# EAGLE design Grove-Encoder v0.9b (EAGLE 6.1)
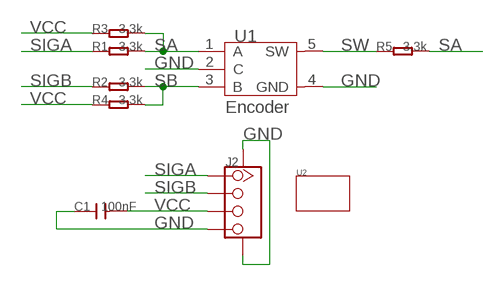
[diagram p0: schematic, sheet 1]

## Parts
C1  100nF  C-0603  [C0603]
J2  TWIG-4P-2.0-SMD-FEMALE-REINFORCE'DD'  [4P-SMD-2.0]
R1  3.3k  R-0603  [R0603]
R2  3.3k  R-0603  [R0603]
R3  3.3k  R-0603  [R0603]
R4  3.3k  R-0603  [R0603]
R5  3.3k  R-0603  [R0603]
U1  Encoder  ROTARY-ENCODE-5P  [5P-13.75X11.7X6.5H]
U2  TWIG'1U'  [1U-DIM-W/-DRILL]

## Nets
GND: C1.1 J2.4 J2.SS1 J2.SS2 U1.2(C) U1.4(GND)
SA: R1.2 R3.2 R5.2 U1.1(A)
SB: R2.2 R4.2 U1.3(B)
SIGA: J2.1 R1.1
SIGB: J2.2 R2.1
SW: R5.1 U1.5(SW)
VCC: C1.2 J2.3 R3.1 R4.1

## Library data of the parts
C1 = Discrete:C*: Ceramic Capacitors
J2 = Connector:TWIG-4P-2.0-SMD-FEMALE-REINFORCE
R1-R5 = Discrete:R*
U1 = template:ROTARY-ENCODE-5P: Rotary Encode With Switch http://www.seeedstudio.com/depot/rotary-encoder-with-switch-p-667.html?cPath=156_160
U2 = moudle:TWIG

## Board
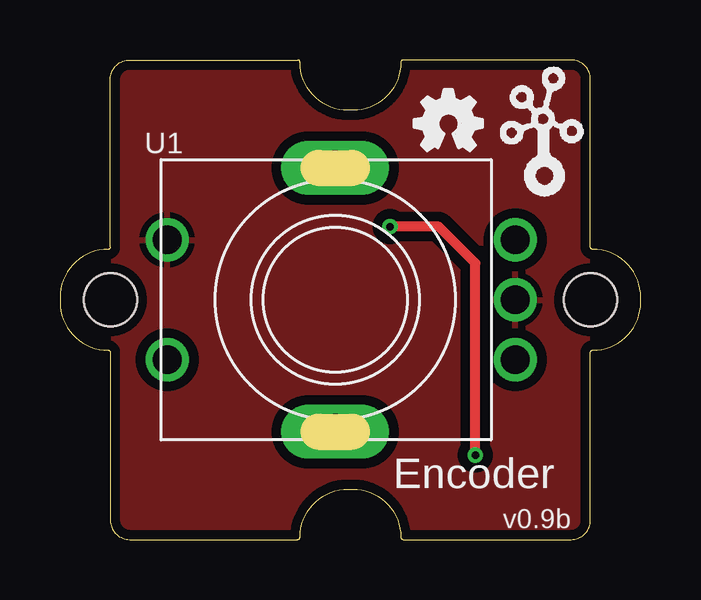
[diagram p1: board, top side]
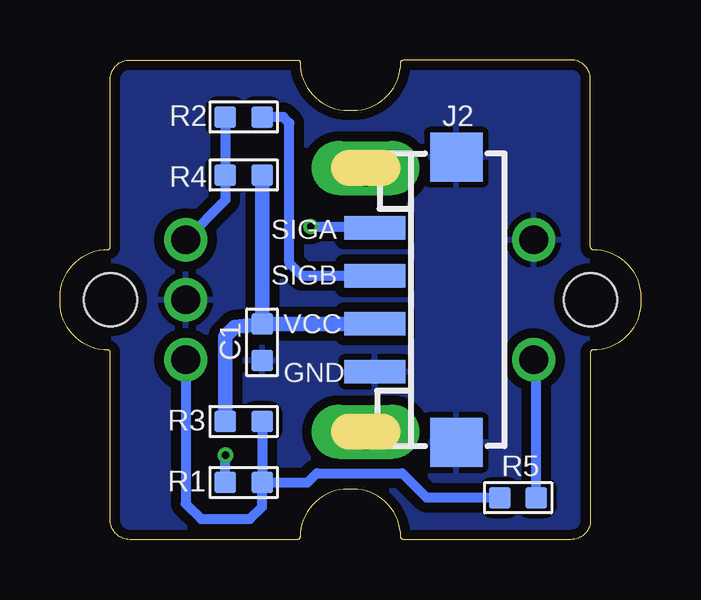
[diagram p2: board, bottom side, seen from below]

Size 24.2 x 20 mm. Coordinates in mm from the lower left corner, seen from the top.
Copper layers (1*16): Top 0.035mm / dielectric 1.5mm / Bottom 0.035mm
Design rules: minimum track width 6mil, minimum drill 12mil, track to track 6mil, track to pad 6mil, pad to pad 6mil, via to via 6mil, smd to smd 0mil, copper to edge 10mil, drill to drill 10mil, minimum pad ring 10mil, minimum via ring 6mil, stop-mask expansion 2mil, vias tented up to drill 100mil, thermal gap 10mil

### Footprints (pad centres in the part's own frame; a part is rotated, then mirrored left to right if it is on the bottom)
C0603 = smd 0.889 x 0.889: 1 -0.762,0; 2 0.762,0
4P-SMD-2.0 = smd 0.965 x 2.54: 1 -3,0; 2 -1,0; 3 1,0; 4 3,0 | smd 2.032 x 2.184: SS1 -5.946,3.4; SS2 5.946,3.4
R0603 = smd 0.889 x 0.889: 1 -0.762,0; 2 0.762,0
5P-13.75X11.7X6.5H = drill 1.2 pad 1.8: 1 -2.5,-7.5; 2 0,-7.5; 3 2.5,-7.5; 4 2.5,7; 5 -2.5,7 | drill 1.5 pad 2 long: P1 -5.5,0; P2 5.5,0
1U-DIM-W/-DRILL = hole 2.2: 0,-10; 0,10

### Placement (x,y rotation side)
C1  15.78,8.22 90 bottom
J2  11.08,10 270 bottom
R1  16.55,2.38 0 bottom
R2  16.55,17.62 180 bottom
R3  16.55,4.92 0 bottom
R4  16.55,15.21 180 bottom
R5  5.11,1.74 180 bottom
U1  11.46,10 90 top
U2  12.1,10 90 top
U$3  [TWIGLOGO_SMALL]  17.94,14.19 0 top
U$4  [OSHW_FILLX100_NOTEXT]  14.77,16.22 0 top

### Tracks (layer width: path | path; a pad name or v marks a point on that pad's centre or on a via)
GND
  pour Bottom (isolate 0.406): 0.04,20.16 24.16,20.16 24.16,-0.16 0.04,-0.16
  pour Top (isolate 0.406): 0.04,20.16 24.16,20.16 24.16,-0.16 0.04,-0.16
SA
  Bottom 0.406: R3.2 R1.2 | U1.1 18.96,1.5 18.32,0.86 16.29,0.86 15.78,1.36 R1.2 | R5.2 8.93,1.74 9.56,2.38 9.69,2.51 9.94,2.76 13.5,2.76 13.88,2.38 R1.2
SB
  Bottom 0.406: R2.2 R4.2 17.31,14.16 U1.3
SIGA  (via drill 0.3 pad 0.64)
  Top 0.406: v17.31,3.52 17.31,11.52 15.78,13.05 v13.75,13.05
  Bottom 0.406: R1.1 v17.31,3.52 | v13.75,13.05 11.72,13.05 11.59,12.92 11.29,12.92 J2.1
SIGB
  Bottom 0.406: J2.2 14.12,11 14.64,11.52 14.64,17.37 14.89,17.62 R2.1 15.91,17.49
SW
  Bottom 0.406: R5.1 4.35,7.39 U1.5
VCC
  Bottom 0.61: J2.3 15.89,9 C1.2 | C1.2 16.93,8.86 17.31,8.48 R3.1 | R4.1 C1.2

### Text on the board
tPlace: Encoder | v0.9b
bPlace: SIGA | SIGB | VCC | GND